# Altium schematic sheet SHDN-IMD-S00-V00-IMDDaughter.SchDoc
size A4
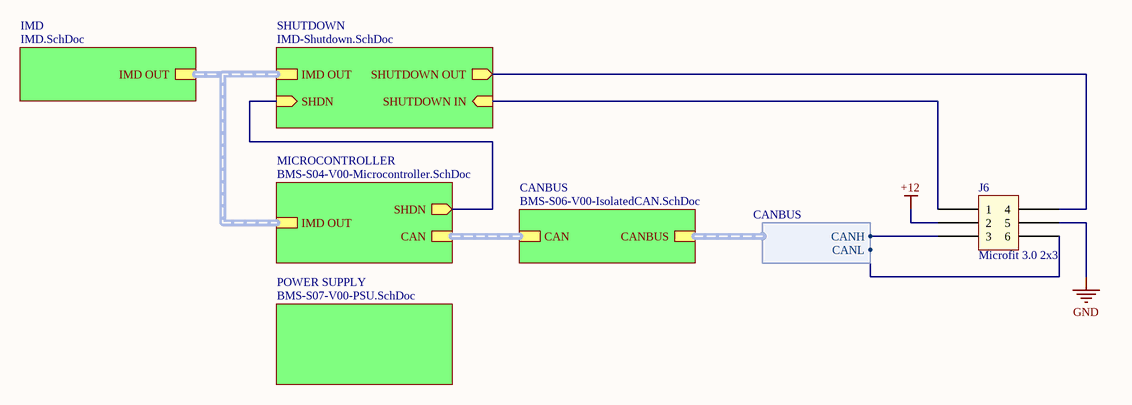
[diagram p0: SHDN-IMD-S00-V00-IMDDaughter.SchDoc]

## Parts
J6  Microfit 3.0 2x3  [Microfit_2X3_R_TH]

## Sub-sheets
CANBUS = BMS-S06-V00-IsolatedCAN.SchDoc: CAN (harness CAN), CANBUS (harness CANBUS)
IMD = IMD.SchDoc: IMD OUT (harness IMD OUT)
MICROCONTROLLER = BMS-S04-V00-Microcontroller.SchDoc: CAN (harness CAN), IMD OUT (harness IMD IN), SHDN (out)
POWER SUPPLY = BMS-S07-V00-PSU.SchDoc: no entries
SHUTDOWN = IMD-Shutdown.SchDoc: SHUTDOWN IN (in), SHUTDOWN OUT (out), IMD OUT (harness SHDN CAN), SHDN (in)

## Harnesses
CANBUS: CANH, CANL

## Nets
+12: J6.2
GND: J6.5
NetJ6_1: J6.1 ; sheet SHUTDOWN/SHUTDOWN IN
NetJ6_3: J6.3 ; sheet CANBUS/CANBUS.CANH
NetJ6_4: J6.4 ; sheet SHUTDOWN/SHUTDOWN OUT
NetJ6_6: J6.6 ; sheet CANBUS/CANBUS.CANL
(unnamed): sheet SHUTDOWN/SHDN, sheet MICROCONTROLLER/SHDN

## Buses and harness runs
harness sheet CANBUS/CAN = sheet MICROCONTROLLER/CAN
harness sheet IMD/IMD OUT = sheet MICROCONTROLLER/IMD OUT = sheet SHUTDOWN/IMD OUT

## Library data of the parts
J6 = Microfit_2x3